# EAGLE schematic SparkFun Qwiic Mux Shield with JST (EAGLE 7.7.0)
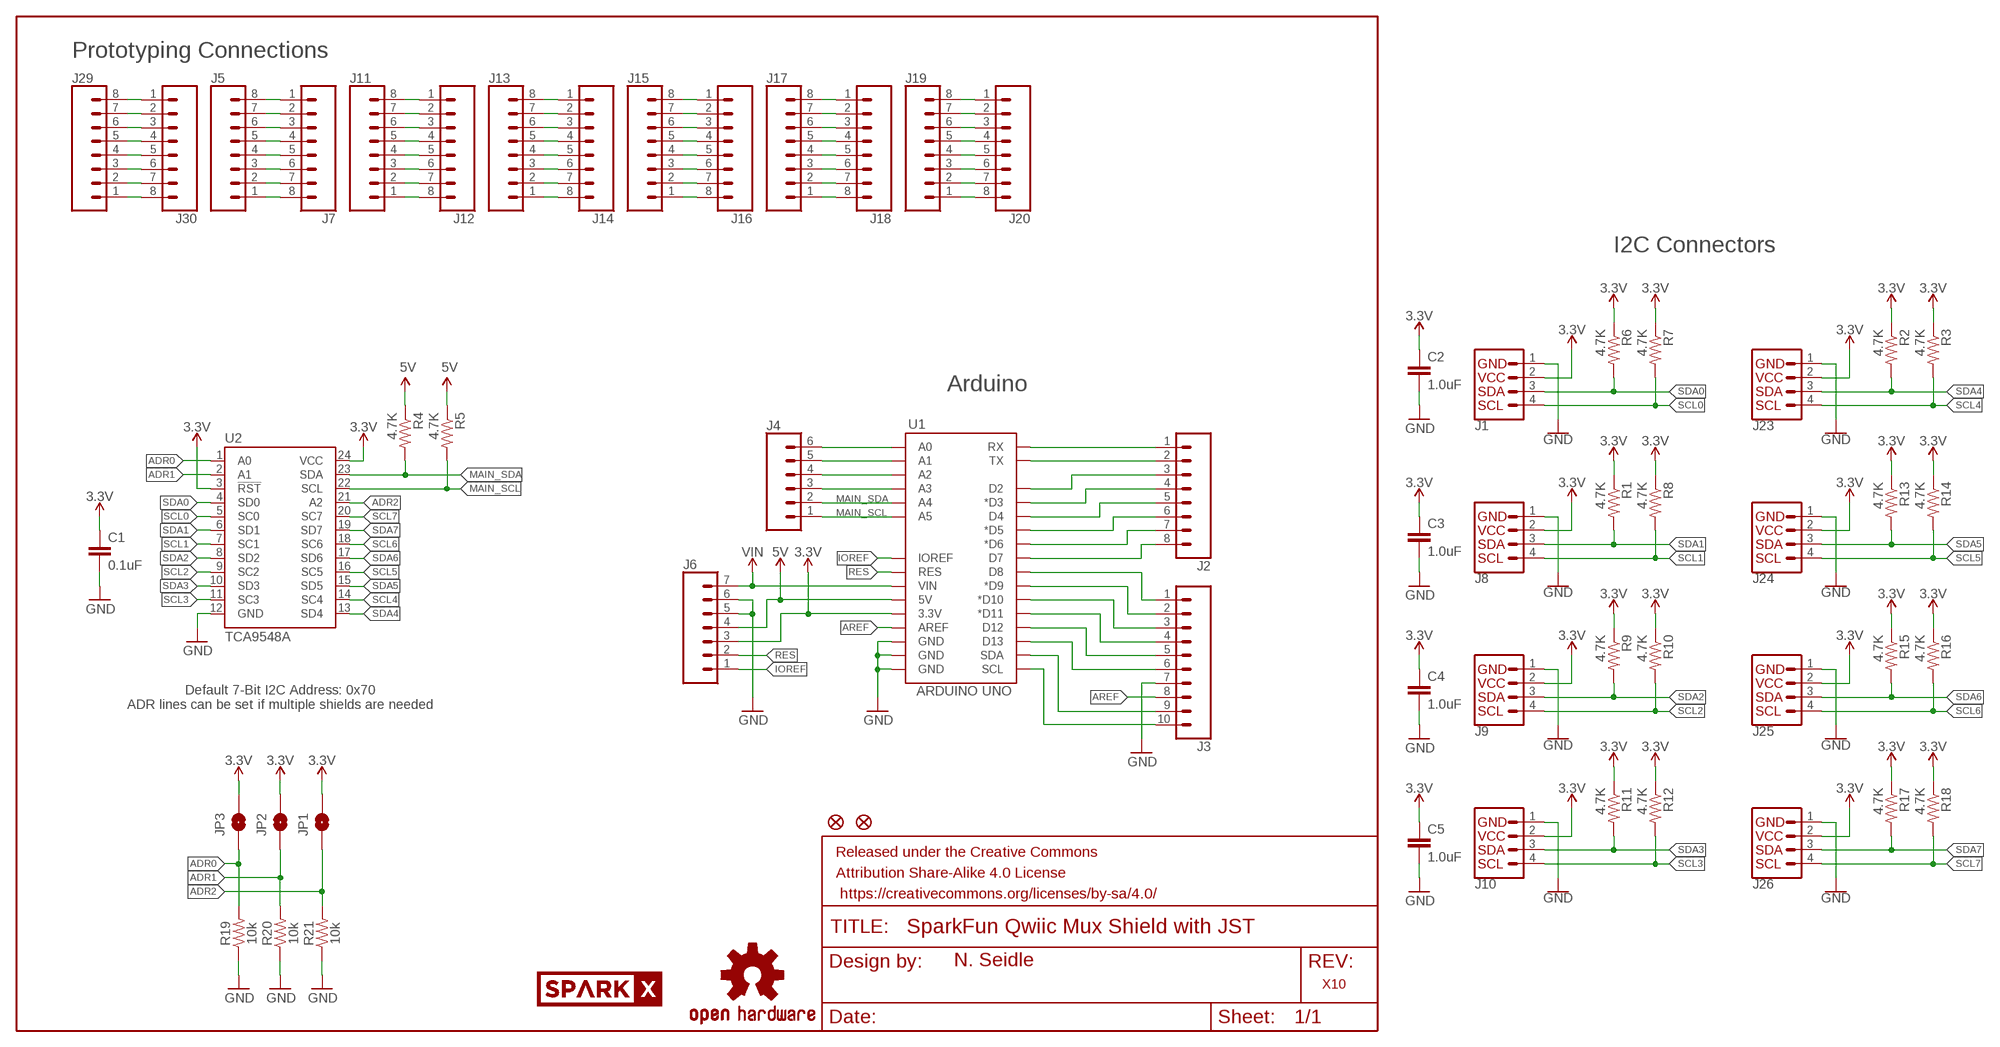
[diagram p0: schematic, sheet 1]

## Parts
C1  0.1uF  0.1UF-0603-25V-(+80/-20%)  [0603]
C2  1.0uF  1.0UF-0603-16V-10%  [0603]
C3  1.0uF  1.0UF-0603-16V-10%  [0603]
C4  1.0uF  1.0UF-0603-16V-10%  [0603]
C5  1.0uF  1.0UF-0603-16V-10%  [0603]
FD1  FIDUCIAL1X2  [FIDUCIAL-1X2]
FD2  FIDUCIAL1X2  [FIDUCIAL-1X2]
FRAME1  FRAME-LETTER  [CREATIVE_COMMONS]
J1  I2C_STANDARDJS-1MM  [1X04_1MM_RA]
J2  CONN_08NO_SILK_FEMALE_PTH  [1X08_NO_SILK]
J3  CONN_10NO_SILK_PTH_FEMALE  [1X10_NO_SILK]
J4  CONN_06NO_SILK_FEMALE_PTH  [1X06_NO_SILK]
J5  CONN_08NO_SILK_FEMALE_PTH  [1X08_NO_SILK]
J6  CONN_07NO_SILK  [1X07_NO_SILK]
J7  CONN_08NO_SILK_FEMALE_PTH  [1X08_NO_SILK]
J8  I2C_STANDARDJS-1MM  [1X04_1MM_RA]
J9  I2C_STANDARDJS-1MM  [1X04_1MM_RA]
J10  I2C_STANDARDJS-1MM  [1X04_1MM_RA]
J11  CONN_08NO_SILK_FEMALE_PTH  [1X08_NO_SILK]
J12  CONN_08NO_SILK_FEMALE_PTH  [1X08_NO_SILK]
J13  CONN_08NO_SILK_FEMALE_PTH  [1X08_NO_SILK]
J14  CONN_08NO_SILK_FEMALE_PTH  [1X08_NO_SILK]
J15  CONN_08NO_SILK_FEMALE_PTH  [1X08_NO_SILK]
J16  CONN_08NO_SILK_FEMALE_PTH  [1X08_NO_SILK]
J17  CONN_08NO_SILK_FEMALE_PTH  [1X08_NO_SILK]
J18  CONN_08NO_SILK_FEMALE_PTH  [1X08_NO_SILK]
J19  CONN_08NO_SILK_FEMALE_PTH  [1X08_NO_SILK]
J20  CONN_08NO_SILK_FEMALE_PTH  [1X08_NO_SILK]
J23  I2C_STANDARDSILK  [1X04]
J24  I2C_STANDARDSILK  [1X04]
J25  I2C_STANDARDSILK  [1X04]
J26  I2C_STANDARDSILK  [1X04]
J29  CONN_08NO_SILK_FEMALE_PTH  [1X08_NO_SILK]
J30  CONN_08NO_SILK_FEMALE_PTH  [1X08_NO_SILK]
JP1  JUMPER-SMT_2_NO_SILK  [SMT-JUMPER_2_NO_SILK]
JP2  JUMPER-SMT_2_NO_SILK  [SMT-JUMPER_2_NO_SILK]
JP3  JUMPER-SMT_2_NO_SILK  [SMT-JUMPER_2_NO_SILK]
LOGO1  OSHW-LOGOMINI  [OSHW-LOGO-MINI]
R1  4.7K  4.7KOHM-1/10W-1%(0603)  [0603-RES]
R2  4.7K  4.7KOHM-1/10W-1%(0603)  [0603-RES]
R3  4.7K  4.7KOHM-1/10W-1%(0603)  [0603-RES]
R4  4.7K  4.7KOHM-1/10W-1%(0603)  [0603-RES]
R5  4.7K  4.7KOHM-1/10W-1%(0603)  [0603-RES]
R6  4.7K  4.7KOHM-1/10W-1%(0603)  [0603-RES]
R7  4.7K  4.7KOHM-1/10W-1%(0603)  [0603-RES]
R8  4.7K  4.7KOHM-1/10W-1%(0603)  [0603-RES]
R9  4.7K  4.7KOHM-1/10W-1%(0603)  [0603-RES]
R10  4.7K  4.7KOHM-1/10W-1%(0603)  [0603-RES]
R11  4.7K  4.7KOHM-1/10W-1%(0603)  [0603-RES]
R12  4.7K  4.7KOHM-1/10W-1%(0603)  [0603-RES]
R13  4.7K  4.7KOHM-1/10W-1%(0603)  [0603-RES]
R14  4.7K  4.7KOHM-1/10W-1%(0603)  [0603-RES]
R15  4.7K  4.7KOHM-1/10W-1%(0603)  [0603-RES]
R16  4.7K  4.7KOHM-1/10W-1%(0603)  [0603-RES]
R17  4.7K  4.7KOHM-1/10W-1%(0603)  [0603-RES]
R18  4.7K  4.7KOHM-1/10W-1%(0603)  [0603-RES]
R19  10k  10KOHM-0603-1/10W-1%  [0603]
R20  10k  10KOHM-0603-1/10W-1%  [0603]
R21  10k  10KOHM-0603-1/10W-1%  [0603]
U1  ARDUINO UNO  ARDUINO_R3_SHIELDNOLABELS  [UNO_R3_SHIELD_NOLABELS]
U2  TCA9548A  [TSSOP28]
U$1  SPARKX-LOGO3  [SPARKX-SMALL]
U$2  SPARKX-LOGO5  [SPARKX-LARGE]

## Nets
3.3V: C1.1 C2.1 C3.1 C4.1 C5.1 J1.2(VCC) J6.3 J8.2(VCC) J9.2(VCC) J10.2(VCC) J23.2(VCC) J24.2(VCC) J25.2(VCC) J26.2(VCC) JP1.2 JP2.2 JP3.2 R1.1 R2.1 R3.1 R6.1 R7.1 R8.1 R9.1 R10.1 R11.1 R12.1 R13.1 R14.1 R15.1 R16.1 R17.1 R18.1 U1.3.3V U2.3(!RST) U2.24(VCC)
5V: J6.4 R4.1 R5.1 U1.5V
A0: J4.6 U1.A0
A1: J4.5 U1.A1
A2: J4.4 U1.A2
A3: J4.3 U1.A3
ADR0: JP3.1 R19.2 U2.1(A0)
ADR1: JP2.1 R20.2 U2.2(A1)
ADR2: JP1.1 R21.2 U2.21(A2)
AREF: J3.8 U1.AREF
D2: J2.3 U1.D2
D3: J2.4 U1.D3(*D3)
D4: J2.5 U1.D4
D5: J2.6 U1.D5(*D5)
D6: J2.7 U1.D6(*D6)
D7: J2.8 U1.D7
D8: J3.1 U1.D8
D9: J3.2 U1.D9(*D9)
D10: J3.3 U1.D10(*D10)
D11: J3.4 U1.D11(*D11)
D12: J3.5 U1.D12
D13: J3.6 U1.D13
GND [vcc]: C1.2 C2.2 C3.2 C4.2 C5.2 J1.1(GND) J3.7 J6.5 J6.6 J8.1(GND) J9.1(GND) J10.1(GND) J23.1(GND) J24.1(GND) J25.1(GND) J26.1(GND) R19.1 R20.1 R21.1 U1.GND@0(GND) U1.GND@1(GND) U1.GND@2(GND) U2.12(GND)
IOREF: J6.1 U1.IOREF
MAIN_SCL: J4.1 R5.2 U1.A5 U2.22(SCL)
MAIN_SCL_1: J3.10 U1.SCL
MAIN_SDA: J4.2 R4.2 U1.A4 U2.23(SDA)
MAIN_SDA_1: J3.9 U1.SDA
N$1: J5.8 J7.1
N$2: J5.7 J7.2
N$3: J5.6 J7.3
N$4: J5.5 J7.4
N$5: J5.4 J7.5
N$6: J5.3 J7.6
N$7: J5.2 J7.7
N$8: J5.1 J7.8
N$9: J11.8 J12.1
N$10: J11.7 J12.2
N$11: J11.6 J12.3
N$12: J11.5 J12.4
N$13: J11.4 J12.5
N$14: J11.3 J12.6
N$15: J11.2 J12.7
N$16: J11.1 J12.8
N$17: J13.8 J14.1
N$18: J13.7 J14.2
N$19: J13.6 J14.3
N$20: J13.5 J14.4
N$21: J13.4 J14.5
N$22: J13.3 J14.6
N$23: J13.2 J14.7
N$24: J13.1 J14.8
N$25: J15.8 J16.1
N$26: J15.7 J16.2
N$27: J15.6 J16.3
N$28: J15.5 J16.4
N$29: J15.4 J16.5
N$30: J15.3 J16.6
N$31: J15.2 J16.7
N$32: J15.1 J16.8
N$33: J17.8 J18.1
N$34: J17.7 J18.2
N$35: J17.6 J18.3
N$36: J17.5 J18.4
N$37: J17.4 J18.5
N$38: J17.3 J18.6
N$39: J17.2 J18.7
N$40: J17.1 J18.8
N$41: J19.8 J20.1
N$42: J19.7 J20.2
N$43: J19.6 J20.3
N$44: J19.5 J20.4
N$45: J19.4 J20.5
N$46: J19.3 J20.6
N$47: J19.2 J20.7
N$48: J19.1 J20.8
N$57: J29.8 J30.1
N$58: J29.7 J30.2
N$59: J29.6 J30.3
N$60: J29.5 J30.4
N$61: J29.4 J30.5
N$62: J29.3 J30.6
N$63: J29.2 J30.7
N$64: J29.1 J30.8
RES: J6.2 U1.RES
RX: J2.1 U1.RX
SCL0: J1.4(SCL) R7.2 U2.5(SC0)
SCL1: J8.4(SCL) R8.2 U2.7(SC1)
SCL2: J9.4(SCL) R10.2 U2.9(SC2)
SCL3: J10.4(SCL) R12.2 U2.11(SC3)
SCL4: J23.4(SCL) R3.2 U2.14(SC4)
SCL5: J24.4(SCL) R14.2 U2.16(SC5)
SCL6: J25.4(SCL) R16.2 U2.18(SC6)
SCL7: J26.4(SCL) R18.2 U2.20(SC7)
SDA0: J1.3(SDA) R6.2 U2.4(SD0)
SDA1: J8.3(SDA) R1.2 U2.6(SD1)
SDA2: J9.3(SDA) R9.2 U2.8(SD2)
SDA3: J10.3(SDA) R11.2 U2.10(SD3)
SDA4: J23.3(SDA) R2.2 U2.13(SD4)
SDA5: J24.3(SDA) R13.2 U2.15(SD5)
SDA6: J25.3(SDA) R15.2 U2.17(SD6)
SDA7: J26.3(SDA) R17.2 U2.19(SD7)
TX: J2.2 U1.TX
VIN [vcc]: J6.7 U1.VIN

## Notes on the sheet
- Prototyping Connections
- I2C Connectors
- Arduino
- Default 7-Bit I2C Address: 0x70
  ADR lines can be set if multiple shields are needed
- N. Seidle
- X10

## Library data of the parts
C1 = SparkFun-Capacitors:0.1UF: 0.1µF ceramic capacitors A capacitor is a passive two-terminal electrical component used to store electrical energy temporarily in an electric field.; PROD_ID: CAP-00810
C2-C5 = SparkFun-Capacitors:1.0UF: 1µF ceramic capacitors A capacitor is a passive two-terminal electrical component used to store electrical energy temporarily in an electric field.; PROD_ID: CAP-00868
FD1 FD2 = SparkFun-Aesthetics:FIDUCIAL: Fiducial Alignment Points Various fiducial points for machine vision alignment.
FRAME1 = SparkFun-Aesthetics:FRAME-LETTER: Schematic Frame Standard 8.5x11 US Letter frame
J1 J8-J10 J23-J26 = SparkX:I2C_STANDARD: SparkFun I2C Standard Pinout Header SparkFun has standardized on a pinout for all I2C based sensor breakouts. This pinout allows I2C boards to be plugged directly into the headers on Arduino Uno compatible boards, and to be daisy chained easily. Example SparkFun Products: SparkFun Atmospheric Sensor Breakout - BME280 <https://www.sparkfun.com/products/13676> SparkFun Altitude/Pressure Sensor Breakout - MPL3115A2 <https://www.sparkfun.com/products/11084> SparkFun TOF Range Finder Sensor - VL6180 <https://www.sparkfun.com/products/12785>
J2 J5 J7 J11-J20 J29 J30 = SparkFun-Connectors:CONN_08: Multi connection point. Often used as Generic Header-pin footprint for 0.1 inch spaced/style header connections On any of the 0.1 inch spaced packages, you can populate with these: Break Away Headers - Straight <https://www.sparkfun.com/products/116> (PRT-00116) Break Away Male Headers - Right Angle <https://www.sparkfun.com/products/553> (PRT-00553) Female Headers <https://www.sparkfun.com/products/115> (PRT-00115) Break Away Headers - Machine Pin <https://www.sparkfun.com/products/117> (PRT-00117) Break Away Female Headers - Swiss Machine Pin <https://www.sparkfun.com/products/743> (PRT-00743) Arduino Stackable Header - 8 Pin <https://www.sparkfun.com/products/9279> (PRT-09279) For SCREWTERMINALS and SPRING TERMINALS visit here: Screw Terimnals on SparkFun.com <https://www.sparkfun.com/search/results?term=Screw+Terminals> (5mm/3.5mm/2.54mm spacing) This device is also useful as a general connection point to wire up your design to another part of your project. Our various solder wires solder well into these plated through hole pads. Hook-Up Wire - Assortment (Stranded, 22 AWG) <https://www.sparkfun.com/products/11375> (PRT-11375) Hook-Up Wire - Assortment (Solid Core, 22 AWG) <https://www.sparkfun.com/products/11367> (PRT-11367) View the entire wire category on our website here <https://www.sparkfun.com/categories/141> Special notes: Molex polarized connector foot print use with SKU : PRT-08231 with associated crimp pins and housings. 1MM SMD Version SKU: PRT-10208 NOTES ON THE VARIANTS LOCK and LOCK_LONGPADS... This footprint was designed to help hold the alignment of a through-hole component (i.e. 6-pin header) while soldering it into place. You may notice that each hole has been shifted either up or down by 0.005 of an inch from it's more standard position (which is a perfectly straight line). This slight alteration caused the pins (the squares in the middle) to touch the edges of the holes. Because they are alternating, it causes a "brace" to hold the component in place. 0.005 has proven to be the perfect amount of "off-center" position when using our standard breakaway headers. Although looks a little odd when you look at the bare footprint, once you have a header in there, the alteration is very hard to notice. Also,if you push a header all the way into place, it is covered up entirely on the bottom side.; PROD_ID: CONN-08438
J3 = SparkFun-Connectors:CONN_10: Multi connection point. Often used as Generic Header-pin footprint for 0.1 inch spaced/style header connections On any of the 0.1 inch spaced packages, you can populate with these: Break Away Headers - Straight <https://www.sparkfun.com/products/116> (PRT-00116) Break Away Male Headers - Right Angle <https://www.sparkfun.com/products/553> (PRT-00553) Female Headers <https://www.sparkfun.com/products/115> (PRT-00115) Break Away Headers - Machine Pin <https://www.sparkfun.com/products/117> (PRT-00117) Break Away Female Headers - Swiss Machine Pin <https://www.sparkfun.com/products/743> (PRT-00743) Arduino Stackable Header - 10 Pin <https://www.sparkfun.com/products/11376> (PRT-11376) For SCREWTERMINALS and SPRING TERMINALS visit here: Screw Terimnals on SparkFun.com <https://www.sparkfun.com/search/results?term=Screw+Terminals> (5mm/3.5mm/2.54mm spacing) This device is also useful as a general connection point to wire up your design to another part of your project. Our various solder wires solder well into these plated through hole pads. Hook-Up Wire - Assortment (Stranded, 22 AWG) <https://www.sparkfun.com/products/11375> (PRT-11375) Hook-Up Wire - Assortment (Solid Core, 22 AWG) <https://www.sparkfun.com/products/11367> (PRT-11367) View the entire wire category on our website here <https://www.sparkfun.com/categories/141> Special notes: Molex polarized connector foot print use with SKU : PRT-08231 with associated crimp pins and housings. 1MM SMD Version SKU: PRT-10208 NOTES ON THE VARIANTS LOCK and LOCK_LONGPADS... This footprint was designed to help hold the alignment of a through-hole component (i.e. 6-pin header) while soldering it into place. You may notice that each hole has been shifted either up or down by 0.005 of an inch from it's more standard position (which is a perfectly straight line). This slight alteration caused the pins (the squares in the middle) to touch the edges of the holes. Because they are alternating, it causes a "brace" to hold the component in place. 0.005 has proven to be the perfect amount of "off-center" position when using our standard breakaway headers. Although looks a little odd when you look at the bare footprint, once you have a header in there, the alteration is very hard to notice. Also,if you push a header all the way into place, it is covered up entirely on the bottom side.; PROD_ID: CONN-11563
J4 = SparkFun-Connectors:CONN_06: Multi connection point. Often used as Generic Header-pin footprint for 0.1 inch spaced/style header connections On any of the 0.1 inch spaced packages, you can populate with these: Break Away Headers - Straight <https://www.sparkfun.com/products/116> (PRT-00116) Break Away Male Headers - Right Angle <https://www.sparkfun.com/products/553> (PRT-00553) Female Headers <https://www.sparkfun.com/products/115> (PRT-00115) Break Away Headers - Machine Pin <https://www.sparkfun.com/products/117> (PRT-00117) Break Away Female Headers - Swiss Machine Pin <https://www.sparkfun.com/products/743> (PRT-00743) Arduino Stackable Header - 6 Pin <https://www.sparkfun.com/products/9280> (PRT-09280) For SCREWTERMINALS and SPRING TERMINALS visit here: Screw Terimnals on SparkFun.com <https://www.sparkfun.com/search/results?term=Screw+Terminals> (5mm/3.5mm/2.54mm spacing) This device is also useful as a general connection point to wire up your design to another part of your project. Our various solder wires solder well into these plated through hole pads. Hook-Up Wire - Assortment (Stranded, 22 AWG) <https://www.sparkfun.com/products/11375> (PRT-11375) Hook-Up Wire - Assortment (Solid Core, 22 AWG) <https://www.sparkfun.com/products/11367> (PRT-11367) View the entire wire category on our website here <https://www.sparkfun.com/categories/141>; PROD_ID: CONN-08437
J6 = SparkFun-Connectors:CONN_07: Multi connection point. Often used as Generic Header-pin footprint for 0.1 inch spaced/style header connections On any of the 0.1 inch spaced packages, you can populate with these: Break Away Headers - Straight <https://www.sparkfun.com/products/116> (PRT-00116) Break Away Male Headers - Right Angle <https://www.sparkfun.com/products/553> (PRT-00553) Female Headers <https://www.sparkfun.com/products/115> (PRT-00115) Break Away Headers - Machine Pin <https://www.sparkfun.com/products/117> (PRT-00117) Break Away Female Headers - Swiss Machine Pin <https://www.sparkfun.com/products/743> (PRT-00743) For SCREWTERMINALS and SPRING TERMINALS visit here: Screw Terimnals on SparkFun.com <https://www.sparkfun.com/search/results?term=Screw+Terminals> (5mm/3.5mm/2.54mm spacing) This device is also useful as a general connection point to wire up your design to another part of your project. Our various solder wires solder well into these plated through hole pads. Hook-Up Wire - Assortment (Stranded, 22 AWG) <https://www.sparkfun.com/products/11375> (PRT-11375) Hook-Up Wire - Assortment (Solid Core, 22 AWG) <https://www.sparkfun.com/products/11367> (PRT-11367) View the entire wire category on our website here <https://www.sparkfun.com/categories/141> Special notes: Molex polarized connector foot print use with SKU : PRT-08231 with associated crimp pins and housings. 1MM SMD Version SKU: PRT-10208 NOTES ON THE VARIANTS LOCK and LOCK_LONGPADS... This footprint was designed to help hold the alignment of a through-hole component (i.e. 6-pin header) while soldering it into place. You may notice that each hole has been shifted either up or down by 0.005 of an inch from it's more standard position (which is a perfectly straight line). This slight alteration caused the pins (the squares in the middle) to touch the edges of the holes. Because they are alternating, it causes a "brace" to hold the component in place. 0.005 has proven to be the perfect amount of "off-center" position when using our standard breakaway headers. Although looks a little odd when you look at the bare footprint, once you have a header in there, the alteration is very hard to notice. Also,if you push a header all the way into place, it is covered up entirely on the bottom side.
JP1-JP3 = SparkFun-Jumpers:JUMPER-SMT_2_NO: Normally open jumper This jumper has two pads in close proximity to each other. Apply solder to close the connection. Round pads are easier to solder for beginners, but are a lot larger. SparkFun Product that uses the round pads: SparkFun EL Sequencer <https://www.sparkfun.com/products/12781>
LOGO1 = SparkFun-Aesthetics:OSHW-LOGO: Open Source Hardware Logo This logo indicates the piece of hardware it is found on incorporates a OSHW license and/or adheres to the definition of open source hardware found here: http://freedomdefined.org/OSHW
R1-R18 = SparkFun-Resistors:4.7KOHM-1/10W-1%(0603): RES-07857; PROD_ID: RES-07857
R19-R21 = SparkFun-Resistors:10KOHM: 10kΩ resistor A resistor is a passive two-terminal electrical component that implements electrical resistance as a circuit element. Resistors act to reduce current flow, and, at the same time, act to lower voltage levels within circuits. - Wikipedia; PROD_ID: RES-00824
U1 = SparkFun-Boards:ARDUINO_R3_SHIELD: Shield form compatible with the Arduino Uno R3.
U2 = SparkX:TCA9548A
U$1 U$2 = SparkX:SPARKX-LOGO

## Net classes
0 Default: width 0.178 mm
1 vcc: width 0.178 mm